# EAGLE design EnviroTron (EAGLE 7.6.0)
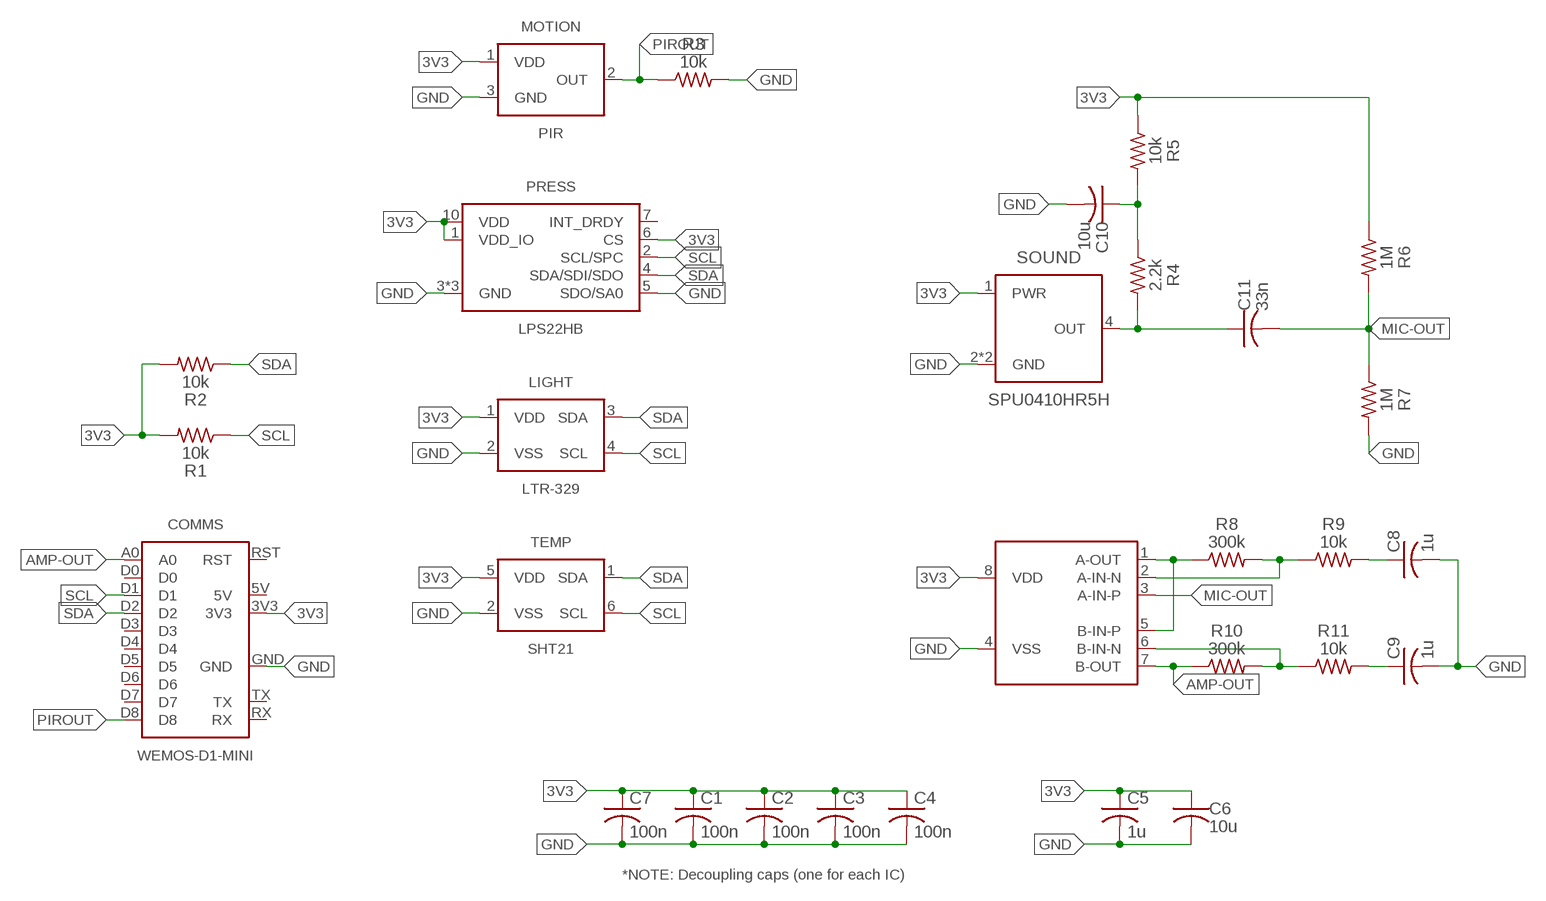
[diagram p0: schematic, sheet 1]

## Parts
C1  100n  C-USC0603  [C0603]
C2  100n  C-USC0603  [C0603]
C3  100n  C-USC0603  [C0603]
C4  100n  C-USC0603  [C0603]
C5  1u  C-USC0603  [C0603]
C6  10u  C-USC0805  [C0805]
C7  100n  C-USC0603  [C0603]
C8  1u  C-USC0603  [C0603]
C9  1u  C-USC0603  [C0603]
C10  10u  C-USC0805  [C0805]
C11  33n  C-USC0805  [C0805]
COMMS  WEMOS-D1-MINI  [WEMOS-D1-MINI]
LIGHT  LTR-329  [CHIPLED4]
MOTION  PIR  [CAN3]
PRESS  LPS22HB  [HLGA-10L]
R1  10k  R-US_R0603  [R0603]
R2  10k  R-US_R0603  [R0603]
R3  10k  R-US_R0603  [R0603]
R4  2.2k  R-US_R0603  [R0603]
R5  10k  R-US_R0603  [R0603]
R6  1M  R-US_R0603  [R0603]
R7  1M  R-US_R0603  [R0603]
R8  300k  R-US_R0603  [R0603]
R9  10k  R-US_R0603  [R0603]
R10  300k  R-US_R0603  [R0603]
R11  10k  R-US_R0603  [R0603]
SOUND  SPU0410HR5H  [BPAD-4]
TEMP  SHT21  [SHT2X-DFN6]
U$1  MCP6002  [MSOP-8]

## Nets
3V3: C1.1 C2.1 C3.1 C4.1 C5.1 C6.1 C7.1 COMMS.3V3 LIGHT.1(VDD) MOTION.1(VDD) PRESS.1(VDD_IO) PRESS.6(CS) PRESS.10(VDD) R1.2 R2.2 R5.1 R6.1 SOUND.1(PWR) TEMP.5(VDD) U$1.8(VDD)
AMP-OUT: COMMS.A0 R10.1 U$1.7(B-OUT)
GND: C1.2 C2.2 C3.2 C4.2 C5.2 C6.2 C7.2 C8.2 C9.2 C10.2 COMMS.GND LIGHT.2(VSS) MOTION.3(GND) PRESS.3(GND) PRESS.5(SDO/SA0) PRESS.8(GND) PRESS.9(GND) R3.2 R7.2 SOUND.2(GND) SOUND.3(GND) TEMP.2(VSS) U$1.4(VSS)
MIC-OUT: C11.2 R6.2 R7.1 U$1.3(A-IN-P)
N$2: R8.1 U$1.1(A-OUT) U$1.5(B-IN-P)
N$5: C10.1 R4.1 R5.2
N$6: R8.2 R9.1 U$1.2(A-IN-N)
N$7: C8.1 R9.2
N$8: C11.1 R4.2 SOUND.4(OUT)
N$9: R10.2 R11.1 U$1.6(B-IN-N)
N$10: C9.1 R11.2
PIROUT: COMMS.D8 MOTION.2(OUT) R3.1
SCL: COMMS.D1 LIGHT.4(SCL) PRESS.2(SCL/SPC) R1.1 TEMP.6(SCL)
SDA: COMMS.D2 LIGHT.3(SDA) PRESS.4(SDA/SDI/SDO) R2.1 TEMP.1(SDA)
Unconnected: COMMS.5V COMMS.D0 COMMS.D3 COMMS.D4 COMMS.D5 COMMS.D6 COMMS.D7 COMMS.RST COMMS.RX COMMS.TX PRESS.7(INT_DRDY)

## Notes on the sheet
- *NOTE: Decoupling caps (one for each IC)

## Library data of the parts
C1-C5 C7-C9 = SmslsTron-1:C-US: CAPACITOR, American symbol
C6 C10 C11 = rcl:C-US: CAPACITOR, American symbol
COMMS = EnviroTron:WEMOS-D1-MINI
LIGHT = EnviroTron:LTR-329
MOTION = EnviroTron:PIR
PRESS = EnviroTron:LPS22HB; MANUFACTURER: STMicroelectronics; MPN: LPS22HBTR; PN-DK: 497-16265-1-ND
R1-R11 = SmslsTron-1:R-US_: RESISTOR, American symbol
SOUND = EnviroTron:SPU0410HR5H; MPN: SPU0410HR5H-PB; PN-DK: 423-1138-6-ND
TEMP = EnviroTron:SHT21
U$1 = EnviroTron:MCP6002; MPN: MCP6002T-I/MS; PN-DK: MCP6002T-I/MSCT-ND

## Board
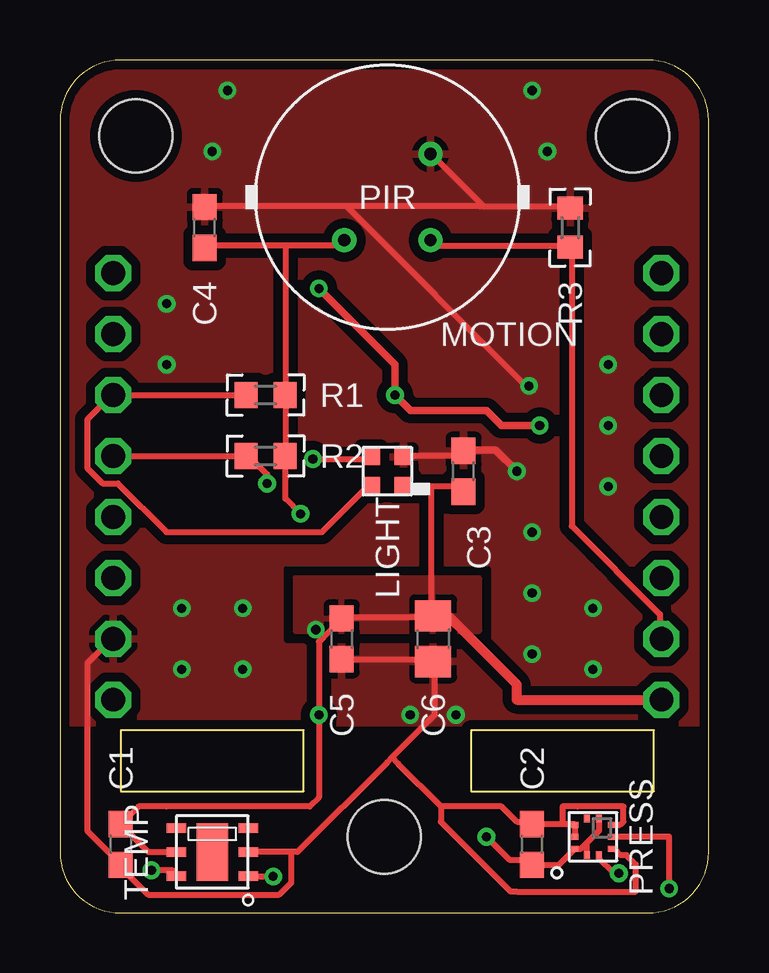
[diagram p1: board, top side]
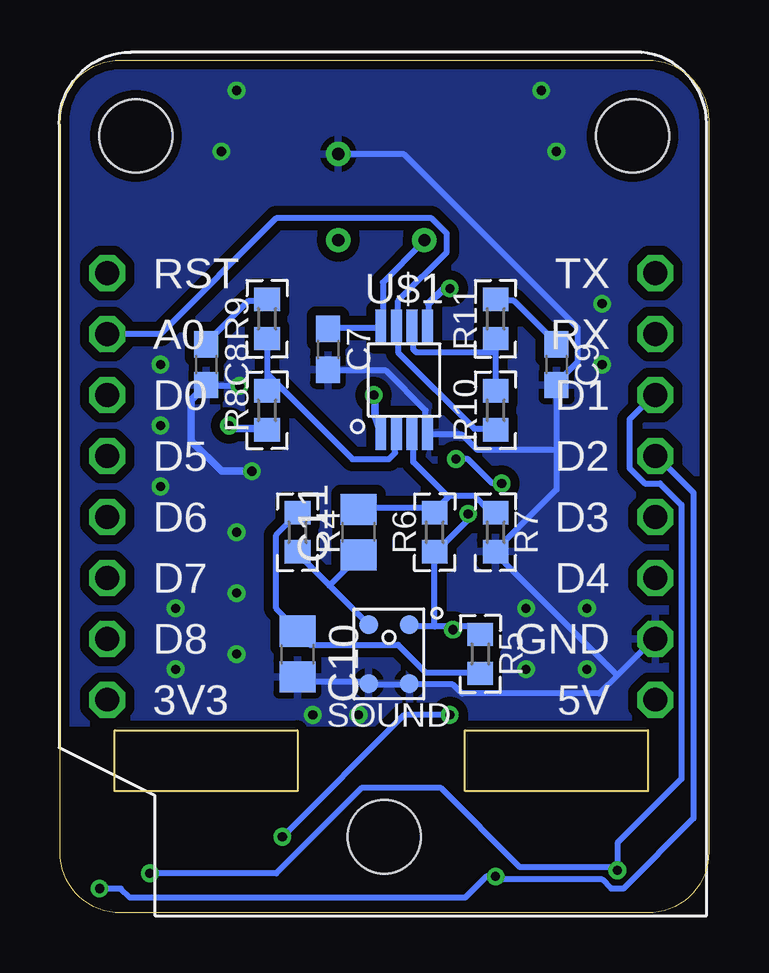
[diagram p2: board, bottom side, seen from below]

Size 27.05 x 35.56 mm. Coordinates in mm from the lower left corner, seen from the top.
Outline: 24.51,35.56 2.54,35.56 arc90 0,33.02 0,2.54 arc90 2.54,0 24.51,0 arc90 27.05,2.54 27.05,33.02 arc90 24.51,35.56
Outline: 2.54,7.62 2.54,5.08 10.16,5.08 10.16,7.62 2.54,7.62
Outline: 17.14,7.62 17.14,5.08 24.77,5.08 24.77,7.62 17.14,7.62
Copper layers (1*16): Top 0.0356mm / dielectric 1.5011mm / Bottom 0.0356mm
Design rules "OshPark-2layer-loosetol": minimum track width 10mil, minimum drill 15mil, track to track 8mil, track to pad 8mil, pad to pad 7mil, via to via 8mil, smd to smd 7mil, copper to edge 15mil, drill to drill 6mil, minimum pad ring 10mil, minimum via ring 7mil, stop-mask expansion 2.5mil, vias tented up to drill 20mil, thermal gap 10mil
Holes 3.05 mm at 3.17,32.38 23.88,32.38 13.53,3.17

### Footprints (pad centres in the part's own frame; a part is rotated, then mirrored left to right if it is on the bottom)
C0603 = smd 1.1 x 1: 1 -0.85,0; 2 0.85,0
C0805 = smd 1.3 x 1.5: 1 -0.95,0; 2 0.95,0
WEMOS-D1-MINI = drill 0.991 octagon: 3V3 -11.43,-8.89; 5V 11.43,-8.89; A0 -11.43,6.35; D0 -11.43,3.81; D1 11.43,3.81; D2 11.43,1.27; D3 11.43,-1.27; D4 11.43,-3.81; D5 -11.43,1.27; D6 -11.43,-1.27; D7 -11.43,-3.81; D8 -11.43,-6.35; GND 11.43,-6.35; RST -11.43,8.89; RX 11.43,6.35; TX 11.43,8.89
CHIPLED4 = smd 0.7 x 0.75: 1 -0.6,-0.675; 2 0.6,-0.675; 3 0.6,0.675; 4 -0.6,0.675
CAN3 = drill 0.508: 1 -1.796,-1.796; 2 1.796,-1.796; 3 1.796,1.796
HLGA-10L = smd 0.3 x 0.25: 1 -0.762,0.25; 2 -0.762,-0.25; 6 0.762,-0.25; 7 0.762,0.25 | smd 0.25 x 0.3: 3 -0.5,-0.762; 4 0,-0.762; 5 0.5,-0.762; 8 0.5,0.762; 9 0,0.762; 10 -0.5,0.762
R0603 = smd 0.965 x 1.067: 1 -0.813,0; 2 0.813,0
BPAD-4 = smd 0.8 x 0.8: 1 0.85,1.23; 2 0.85,-1.23; 3 -0.85,-1.23; 4 -0.85,1.23
SHT2X-DFN6 = smd 0.4 x 0.8: 1 -1,-1.5; 2 0,-1.5; 3 1,-1.5; 4 1,1.5; 5 0,1.5; 6 -1,1.5 | smd 2.4 x 1.3: 7 0,0
MSOP-8 = smd 0.45 x 1.45: 1 -0.975,-2.2; 2 -0.325,-2.2; 3 0.325,-2.2; 4 0.975,-2.2; 5 0.975,2.2; 6 0.325,2.2; 7 -0.325,2.2; 8 -0.975,2.2

### Placement (x,y rotation side)
C1  2.54,2.86 270 top
C2  19.68,2.86 90 top
C3  16.83,18.41 90 top
C4  6.03,28.57 90 top
C5  11.75,11.43 270 top
C6  15.56,11.43 270 top
C7  15.88,23.5 270 bottom
C8  20.95,22.86 270 bottom
C9  6.35,22.86 270 bottom
C10  17.14,10.79 270 bottom
C11  14.61,15.88 90 bottom
COMMS  13.65,17.78 0 bottom
LIGHT  13.65,18.41 90 top
MOTION  13.65,29.84 0 top
PRESS  22.23,3.17 90 top
R1  8.57,21.59 0 top
R2  8.57,19.05 0 top
R3  21.27,28.57 90 top
R4  17.14,15.88 270 bottom
R5  9.53,10.79 270 bottom
R6  11.43,15.88 90 bottom
R7  8.89,15.88 270 bottom
R8  18.41,20.95 90 bottom
R9  18.41,24.77 90 bottom
R10  8.89,20.95 90 bottom
R11  8.89,24.77 90 bottom
SOUND  13.34,10.79 0 bottom
TEMP  6.35,2.54 90 top
U$1  12.7,22.23 0 bottom

### Tracks (layer width: path | path; a pad name or v marks a point on that pad's centre or on a via)
3V3  (via drill 0.38)
  Top 0.254: R1.2 R2.2 | R2.2 | R1.2 | 9.4,27.81 11.68,27.81 11.81,27.94 MOTION.1 | 9.4,27.81 6.1,27.81 C4.1 | 9.4,27.81 R1.2 | 25.15,8.89 COMMS.3V3 | TEMP.5 4.83,2.54 3.68,2.54 3.11,3.11 2.54,3.68 C1.1 3.28,4.45 4.45,4.45 10.41,4.45 10.79,4.83 v10.79,8.26 10.79,11.3 10.99,11.49 | 15.49,17.78 16.64,17.78 16.76,17.65 C3.1 | 15.49,17.78 14.35,17.78 LIGHT.1 | C6.1 15.49,12.32 11.81,12.32 C5.1 11.68,12.19 10.99,11.49 | 15.49,17.78 15.49,12.45 C6.1 | v10.67,11.81 10.92,11.56 10.99,11.49 | 15.62,12.32 C6.1 | R2.2 9.4,17.27 v10.03,16.64 | PRESS.6 22.48,3.42 22.23,3.17 | PRESS.1 21.98,2.92 22.23,3.17 | 22.23,3.17 21.73,2.67 PRESS.10 20.8,2.01 C2.1 19.68,2.03 19.49,2.22 18.73,2.22 v17.78,3.17
  Top 0.406: COMMS.3V3 25.02,8.89 19.05,8.89 19.05,9.53 16.51,12.06 16.2,12.38 C6.1
  Bottom 0.254: C7.1 15.88,24.38 13.72,24.38 U$1.8 13.59,24.51 13.59,26.29 11.94,27.94 MOTION.1 | 10.67,11.94 9.78,11.94 9.53,11.68 R5.1 | 10.67,11.94 11.43,11.94 | 11.43,11.94 12.45,11.94 SOUND.1 | 11.43,11.94 11.43,14.99 | 11.43,14.99 R6.1 11.43,14.99 | v10.67,11.81 10.67,11.94 | v10.03,16.64 10.03,16.38 11.43,14.99 | v10.79,8.26 12.7,8.26 v17.78,3.17
  pour Top (isolate 0.305): 9.84,13.97 17.46,13.97 17.46,11.75 9.84,11.75
AMP-OUT
  Bottom 0.254: R10.1 8.89,20.19 9.78,20.19 12.95,23.37 12.95,24.38 U$1.7 12.95,24.51 12.95,25.53 10.92,27.56 10.92,28.32 11.56,28.96 18.03,28.96 22.86,24.13 25.02,24.13 COMMS.A0
GND  (via drill 0.38)
  Top 0.254: LIGHT.2 14.35,19.05 16.64,19.05 16.76,19.18 C3.2 16.89,19.3 | 17.59,29.53 15.49,31.62 MOTION.3 | 17.59,29.53 17.65,29.46 21.21,29.46 R3.2 | 11.94,29.46 17.53,29.46 17.59,29.53 | 11.94,29.46 6.1,29.46 C4.2 | 11.94,29.46 19.43,21.97 v19.56,21.97 | 9.65,2.54 9.91,2.54 13.65,6.29 13.84,6.48 | 9.65,2.54 7.87,2.54 TEMP.2 | 13.84,6.48 15.62,8.26 15.62,10.41 C6.2 15.49,10.54 11.81,10.54 C5.2 | COMMS.GND 2.16,11.43 1.14,10.41 1.14,3.43 2.54,2.03 C1.2 2.54,1.91 3.68,0.76 9.14,0.76 9.65,1.27 9.65,2.54 | PRESS.9 PRESS.8 21.43,3.71 20.95,3.71 | 20.95,3.71 C2.2 19.58,3.81 19.05,3.81 18.41,4.45 15.88,4.45 | PRESS.5 23.36,3.67 23.5,3.81 23.5,4.45 21.59,4.45 20.95,4.45 20.95,3.71 | PRESS.3 23.11,2.67 23.37,2.41 23.62,2.41 24,2.03 24,0.89 19.05,0.89 18.8,0.89 18.41,1.27 15.88,3.81 15.88,4.45 | 19.05,18.29 v19.05,18.41 | 15.88,4.45 14.1,6.22 13.84,6.48
  Top 0.305: 16.89,19.3 18.16,19.3 v19.05,18.41
  Bottom 0.254: v19.56,21.97 20.95,21.97 C8.2 | C7.2 15.88,22.61 13.46,22.61 11.81,20.95 11.81,20.07 U$1.4 11.68,19.94 10.29,19.94 9.65,19.3 6.35,19.3 | 6.35,19.3 6.35,21.97 C9.2 6.35,22.1 5.46,22.99 5.46,24.38 12.7,31.62 15.37,31.62 MOTION.3 | 6.35,19.3 6.35,17.65 8.89,15.11 R7.2 8.89,14.99 3.81,9.91 | C10.2 17.14,9.78 17.02,9.65 14.22,9.65 SOUND.3 14.1,9.53 12.57,9.53 SOUND.2 12.45,9.53 10.67,9.53 10.29,9.14 4.57,9.14 3.81,9.91 | 3.81,9.91 2.29,11.43 COMMS.GND
  Bottom 0.305: v19.05,18.41 20.32,18.41 21.59,19.68 21.59,21.38 C8.2
  other vias: 5.08,12.7 7.62,12.7 7.62,10.16 5.08,10.16 19.68,13.34 22.23,12.7 19.68,10.79 22.23,10.16 19.68,15.88 20.32,31.75 19.68,34.29 6.99,34.29 6.35,31.75 4.45,25.4 4.45,22.86 22.86,22.86 22.86,20.32 22.86,17.78 14.61,8.26 16.51,8.26
  pour Top (isolate 0.381, rank 2): 0.32,0.32 0.32,35.56 26.99,35.56 26.99,0.32
  pour Bottom (isolate 0.381, rank 2): 0.32,0.32 0.32,35.56 26.99,35.56 26.99,0.32
MIC-OUT
  Bottom 0.254: 10.86,17.34 11.43,16.76 R6.2 11.43,16.89 14.61,16.89 C11.2 | 10.86,17.34 10.79,17.4 9.78,17.4 9.14,16.76 8.89,16.76 R7.1 | U$1.3 12.32,19.94 12.32,18.8 10.92,17.4 10.86,17.34
N$1
  cutout Bottom (isolate 1.27): 0.64,7.62 26.67,7.62 26.67,0.64 0.64,0.64
  cutout Top (isolate 1.27): 0.64,7.62 26.67,7.62 26.67,0.64 0.64,0.64
N$2  (via drill 0.38)
  Top 0.305: v20,20.32 18.41,20.32 17.78,20.95 14.61,20.95 v13.97,21.59 13.97,22.86 v10.79,26.04
  Bottom 0.254: 13.91,20.7 13.72,20.07 U$1.1 | 18.41,20.19 R8.1 | 11.68,25.4 11.68,24.51 U$1.5
  Bottom 0.305: 13.91,20.7 13.91,21.34 v13.97,21.59 | 18.41,20.19 19.88,20.19 v20,20.32 | v10.79,26.04 11.05,26.04 11.68,25.4
N$5
  Bottom 0.254: R5.2 9.53,10.03 11.81,10.03 12.95,11.18 16.64,11.18 17.14,11.68 C10.1 17.14,11.81 18.03,12.7 18.03,15.75 17.14,16.64 R4.1
N$6
  Bottom 0.254: 18.41,22.48 18.41,23.88 R9.1 | 18.41,22.48 18.41,21.84 R8.2 | 18.41,22.48 14.86,18.92 13.34,18.92 13.08,19.18 13.08,19.94 U$1.2
N$7
  Bottom 0.254: R9.2 18.41,25.53 19.18,25.53 20.95,23.75 C8.1
N$8
  Bottom 0.254: 15.81,13.65 17.14,14.99 R4.2 | 15.81,13.65 14.22,12.06 SOUND.4 | C11.1 14.61,14.86 15.75,13.72 15.81,13.65
N$9
  Bottom 0.254: 8.89,23.37 8.89,23.88 R11.1 | 8.89,23.37 8.89,21.84 R10.2 | 8.89,23.37 12.19,23.37 12.32,23.5 12.32,24.38 U$1.6
N$10
  Bottom 0.254: R11.2 8.89,25.53 8.13,25.53 6.35,23.75 C9.1
PIROUT
  Top 0.254: MOTION.2 15.49,27.94 15.62,27.81 21.21,27.81 R3.1 21.34,27.69 21.34,16.13 25.02,12.45 25.02,11.43 COMMS.D8
SCL  (via drill 0.38)
  Top 0.254: v3.81,1.78 4.7,1.78 4.83,1.65 TEMP.6 | LIGHT.4 12.95,17.78 12.83,17.78 10.92,15.88 4.45,15.88 2.41,17.91 1.78,17.91 1.14,18.54 1.14,20.57 2.16,21.59 COMMS.D1 2.29,21.59 7.75,21.59 R1.1 | 22.48,2.29 PRESS.2 22.48,2.29 23.11,1.65 23.24,1.65 v23.3,1.65
  Bottom 0.254: v23.3,1.65 18.03,1.65 14.48,5.21 11.18,5.21 7.87,1.91 3.94,1.91 v3.81,1.78 3.81,1.91 3.81,2.92 1.14,5.59 1.14,17.02 2.03,17.91 2.67,17.91 3.3,18.54 3.3,20.57 2.29,21.59 COMMS.D1
SDA  (via drill 0.38)
  Top 0.254: v8.89,1.52 7.87,1.52 TEMP.1 | v10.54,18.92 12.95,18.92 LIGHT.3 | v8.64,17.91 8.64,18.29 7.87,19.05 R2.1 7.75,19.05 2.29,19.05 COMMS.D2 | v25.4,1.02 25.4,3.17 PRESS.4
  Bottom 0.254: v25.4,1.02 24.51,1.02 24.13,0.64 10.16,0.64 9.27,1.52 v8.89,1.52 8.89,1.4 4.45,1.4 4.06,1.02 3.56,1.02 0.64,3.94 0.64,17.53 2.16,19.05 COMMS.D2 | v10.54,18.92 10.03,18.92 9.02,17.91 v8.64,17.91